# EAGLE design LiPo-USB-Charger-v10 (EAGLE 6.2)
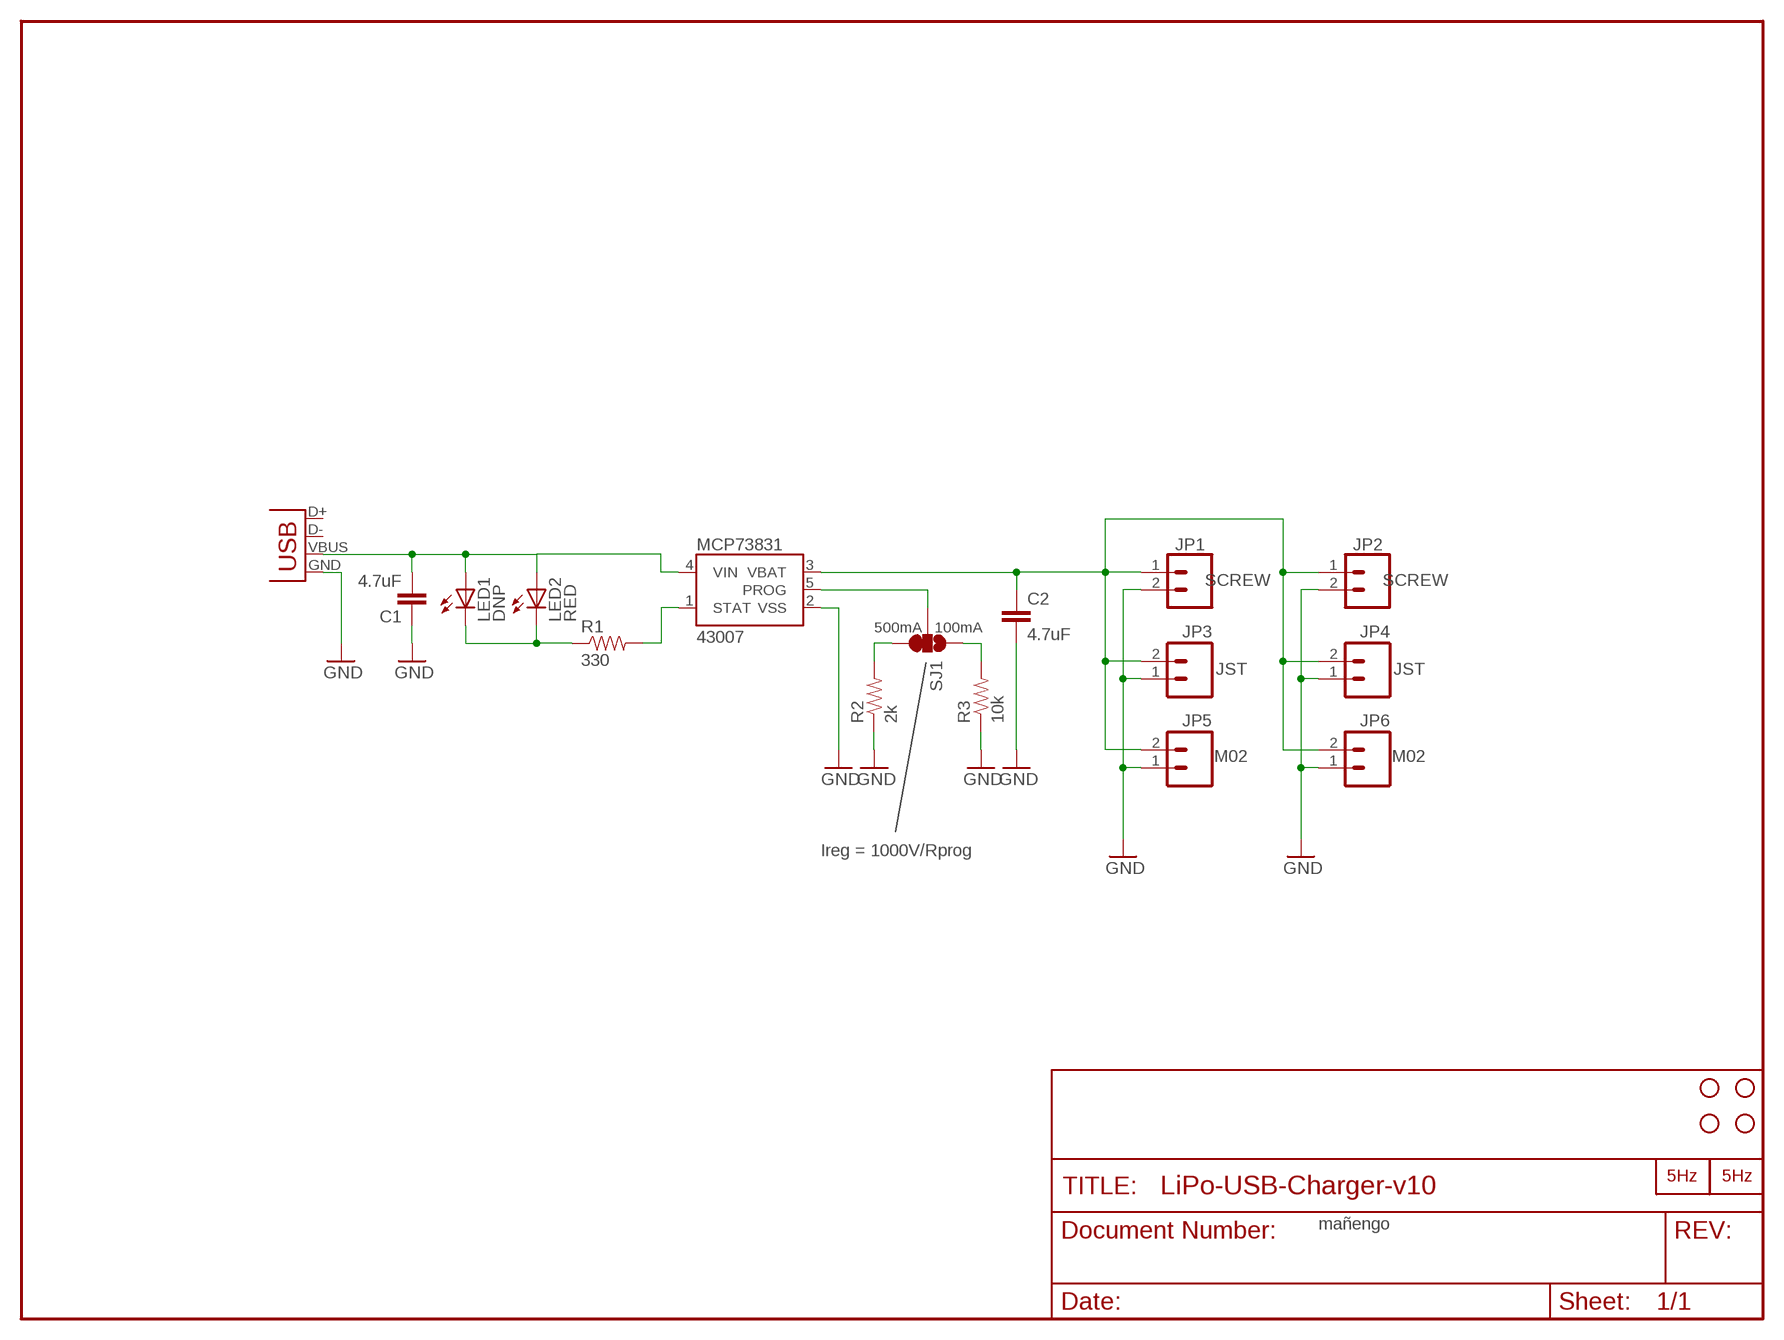
[diagram p0: schematic, sheet 1]

## Parts
C1  4.7uF  CAP0402-CAP  [0402-CAP]
C2  4.7uF  CAP0402-CAP  [0402-CAP]
JP1  SCREW  M023.5MM-NO_SILK  [SCREWTERMINAL-3.5MM-2-NS]
JP2  SCREW  M023.5MM-NO_SILK  [SCREWTERMINAL-3.5MM-2-NS]
JP3  JST  M02JST-PTH-2  [JST-2-PTH]
JP4  JST  M02JST-PTH-2  [JST-2-PTH]
JP5  M02  M02PTH  [1X02]
JP6  M02  M02PTH  [1X02]
JP7  STAND-OFF  [STAND-OFF]
JP8  STAND-OFF  [STAND-OFF]
JP9  STAND-OFF  [STAND-OFF]
JP10  STAND-OFF  [STAND-OFF]
LED1  DNP  LED3MM  [LED3MM]
LED2  RED  LED0603  [LED-0603]
MCP73831  43007  MCP73831  [SOT23-5]
R1  330  RESISTOR0402-RES  [0402-RES]
R2  2k  RESISTOR0402-RES  [0402-RES]
R3  10k  RESISTOR0402-RES  [0402-RES]
SJ1  SOLDERJUMPER_2WAYS  [SJ_3]
U$1  LOGO_COPPER10MM  [LOGO_COP_10MM]
U$2  LOGO2_SILK5MM  [LOGO2_5MM]
X1  USBSMD  [USB-MINIB]

## Nets
GND: C1.1 C2.2 JP1.2 JP2.2 JP3.1 JP4.1 JP5.1 JP6.1 MCP73831.2(VSS) R2.1 R3.1 X1.GND
N$1: C1.2 LED1.A LED2.A MCP73831.4(VIN) X1.VBUS
N$2: MCP73831.1(STAT) R1.2
N$3: LED1.K(C) LED2.C R1.1
N$4: R2.2 SJ1.3
N$7: R3.2 SJ1.1
PROG: MCP73831.5(PROG) SJ1.2
VBAT: C2.1 JP1.1 JP2.1 JP3.2 JP4.2 JP5.2 JP6.2 MCP73831.3(VBAT)
Unconnected: X1.D+ X1.D-

## Notes on the sheet
- 500mA | 100mA
- Ireg = 1000V/Rprog
- mañengo

## Library data of the parts
C1 C2 = SparkFun:CAP: Capacitor Standard 0603 ceramic capacitor, and 0.1" leaded capacitor.
JP1-JP6 = SparkFun:M02: Header 2 Standard 2-pin 0.1" header. Use with straight break away headers (SKU : PRT-00116), right angle break away headers (PRT-00553), swiss pins (PRT-00743), machine pins (PRT-00117), and female headers (PRT-00115). Molex polarized connector foot print use with SKU : PRT-08233 with associated crimp pins and housings.
JP7-JP10 = SparkFun:STAND-OFF: Stand Off This is the mechanical footprint for a #4 phillips button head screw. Use the keepout ring to avoid running the screw head into surrounding components. SKU : PRT-00447
LED1 LED2 = SparkFun:LED: LEDs Standard schematic elements and footprints for 5mm, 3mm, 1206, and 0603 sized LEDs. 5mm - Spark Fun Electronics SKU : COM-00529 (and others)
MCP73831 = SparkFun:MCP73831: Microchip's MCP73831 Miniature single cell, fully integrated Li-Ion, Li-polymer charge management controller http://ww1.microchip.com/downloads/en/DeviceDoc/21984a.pdf
R1-R3 = SparkFun:RESISTOR: Resistor Basic schematic elements and footprints for 0603, 1206, and PTH resistors.
SJ1 = SparkFun:SOLDERJUMPER_2WAY: Solder Jumper 2 way solder jumper
U$1 = LOGO:LOGO_COPPER
U$2 = LOGO:LOGO2_SILK: PRINCIPAL
X1 = SparkFun:USB: USB Connectors USB-B-PTH is fully proven SKU : PRT-00139 USB-miniB is fully proven SKU : PRT-00587 USB-A-PCB is untested. USB-A-H is throughly reviewed, but untested. Spark Fun Electronics SKU : PRT-00437 USB-B-SMT is throughly reviewed, but untested. Needs silkscreen touching up. USB-A-S has not been used/tested USB-MB-H has not been used/tested

## Board
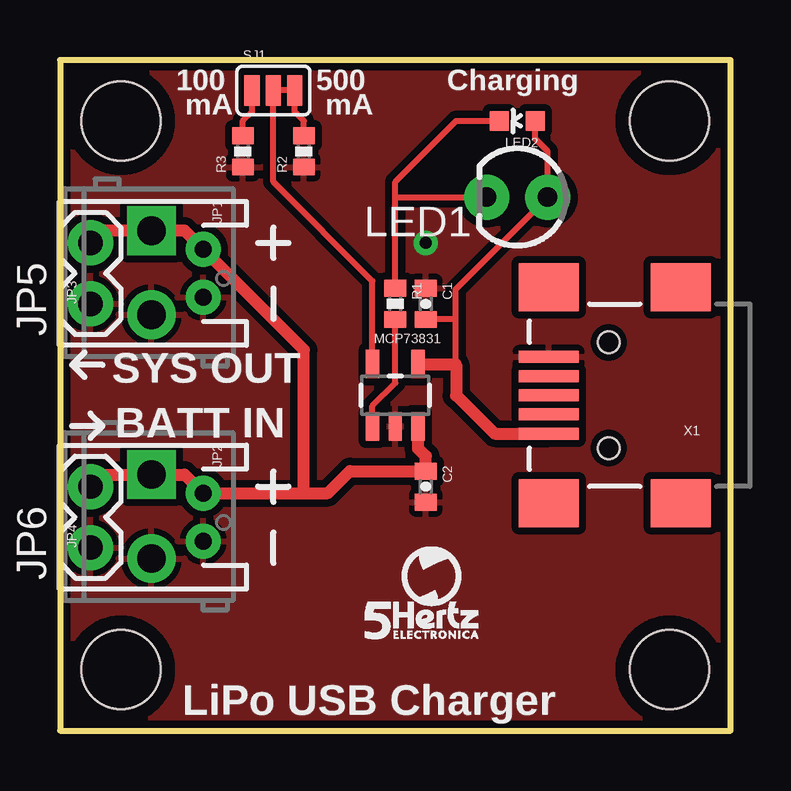
[diagram p1: board, top side]
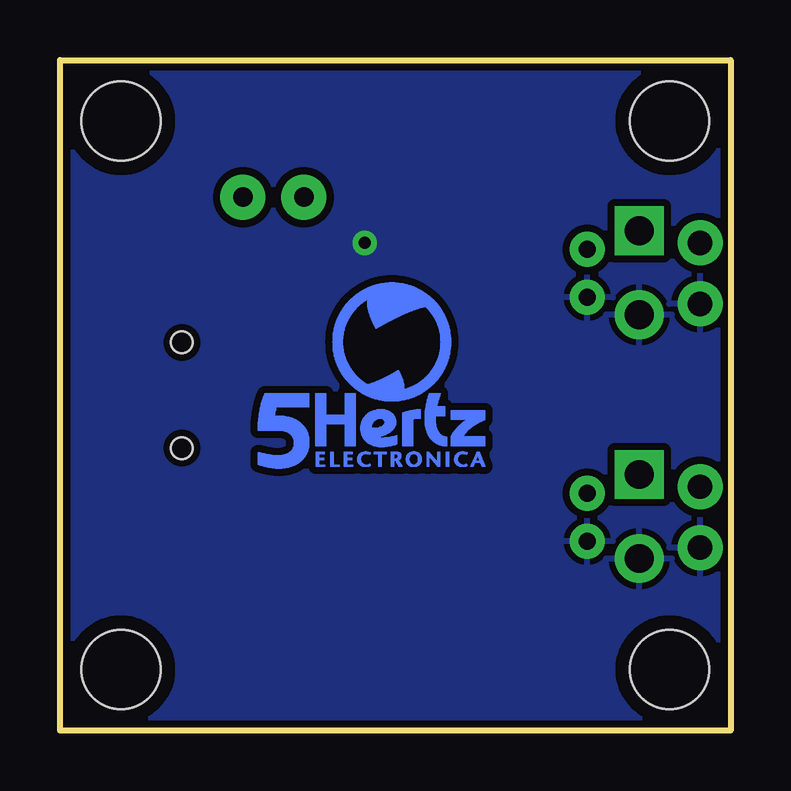
[diagram p2: board, bottom side, seen from below]

Size 27.94 x 27.94 mm. Coordinates in mm from the lower left corner, seen from the top.
Outline: 0,0 27.94,0 27.94,27.94 0,27.94 0,0
Copper layers (1*16): Top 0.035mm / dielectric 1.5mm / Bottom 0.035mm
Design rules: minimum track width 8mil, minimum drill 20mil, track to track 8mil, track to pad 8mil, pad to pad 8mil, via to via 8mil, smd to smd 8mil, copper to edge 8mil, drill to drill 8mil, minimum pad ring 12mil, minimum via ring 10mil, stop-mask expansion 4mil, vias tented up to drill 20mil, thermal gap 10mil

### Footprints (pad centres in the part's own frame; a part is rotated, then mirrored left to right if it is on the bottom)
0402-CAP = smd 0.7 x 0.9: 1 -0.65,0; 2 0.65,0
SCREWTERMINAL-3.5MM-2-NS = drill 1.2 pad 2.032 square: 1 0,0 | drill 1.2 pad 2.032: 2 3.5,0
JST-2-PTH = drill 0.7 pad 1.448: 1 -1,0; 2 1,0
1X02 = drill 1.016 pad 1.88: 1 0,0; 2 2.54,0
STAND-OFF = hole 3.302: 0,0
LED3MM = drill 0.813 pad 1.88: A -1.27,0; K 1.27,0
LED-0603 = smd 0.8 x 0.8: A 0,-0.75; C 0,0.75
SOT23-5 = smd 0.55 x 1.2: 1 -0.95,-1.3; 2 0,-1.3; 3 0.95,-1.3; 4 0.95,1.3; 5 -0.95,1.3
0402-RES = smd 0.7 x 0.9: 1 -0.65,0; 2 0.65,0
SJ_3 = smd 0.635 x 1.27: 1 -0.889,0; 2 0,0; 3 0.889,0
USB-MINIB = smd 2.5 x 0.5: D+ 2.5,0; D- 2.5,0.8; GND 2.5,-1.6; ID 2.5,-0.8; VBUS 2.5,1.6 | smd 2.5 x 2: MTN1 -3,4.5; MTN2 2.5,4.5; MTN3 -3,-4.5; MTN4 2.5,-4.5 | hole 0.9: 0,2.2; 0,-2.2

### Placement (x,y rotation side)
C1  15.24,17.78 270 top
C2  15.24,10.16 270 top
JP1  3.81,20.83 270 top
JP2  3.81,10.67 270 top
JP3  5.97,19.05 90 top
JP4  5.97,8.89 90 top
JP5  1.27,17.78 90 top
JP6  1.27,7.62 90 top
JP7  25.4,2.54 0 top
JP8  2.54,25.4 0 top
JP9  2.54,2.54 0 top
JP10  25.4,25.4 0 top
LED1  19.05,22.23 180 top
LED2  19.05,25.4 90 top
MCP73831  13.97,13.97 0 top
R1  13.97,17.78 270 top
R2  10.16,24.13 90 top
R3  7.62,24.13 90 top
SJ1  8.89,26.67 0 top
U$1  19.68,10.92 0 bottom
U$2  12.7,3.81 0 top
X1  22.86,13.97 180 top

### Tracks (layer width: path | path; a pad name or v marks a point on that pad's centre or on a via)
GND  (via drill 0.51)
  other vias: 15.24,20.32
  pour Bottom (isolate 0.305): 0,0 0,27.94 27.94,27.94 27.94,0
  pour Top (isolate 0.305): 0,0 0,27.94 27.94,27.94 27.94,0
N$1
  Top 0.254: 16.48,15.27 16.48,17.14 | 16.48,17.14 16.48,18.39 LED1.A 20.32,24.13 19.8,24.65 LED2.A | C1.2 16.46,17.13 16.48,17.14
  Top 0.508: X1.VBUS 18.11,12.37 16.51,13.97 16.51,15.24 16.48,15.27 MCP73831.4
N$2
  Top 0.254: MCP73831.1 13.02,13.53 13.97,14.48 R1.2
N$3
  Top 0.254: R1.1 13.97,22.23 | 13.97,22.23 13.97,22.86 16.51,25.4 LED2.C | 13.97,22.23 LED1.K
N$4
  Top 0.254: R2.2 10.16,25.4 9.78,25.78 SJ1.3
N$5
  Top 0.254: 9.91,26.67 8.76,26.67
N$7
  Top 0.254: R3.2 7.62,25.4 8,25.78 SJ1.1
PROG
  Top 0.254: SJ1.2 8.89,22.86 13.02,18.73 MCP73831.5
VBAT
  Top 0.508: 10.16,9.89 JP4.2 5.19,10.67 JP2.1 1.78,10.67 JP6.2 | 10.16,9.89 11.16,9.89 12.08,10.81 C2.1 15.24,11.43 14.92,11.75 MCP73831.3 | JP5.2 1.78,20.83 JP1.1 5.19,20.83 JP3.2 10.16,15.86 10.16,9.89

### Text on the board
tPlace: 100 | 500 | Charging | mA | mA | SYS OUT | BATT IN | LiPo USB Charger